# EAGLE schematic Temperature Measure Eagle (EAGLE 9.6.1)
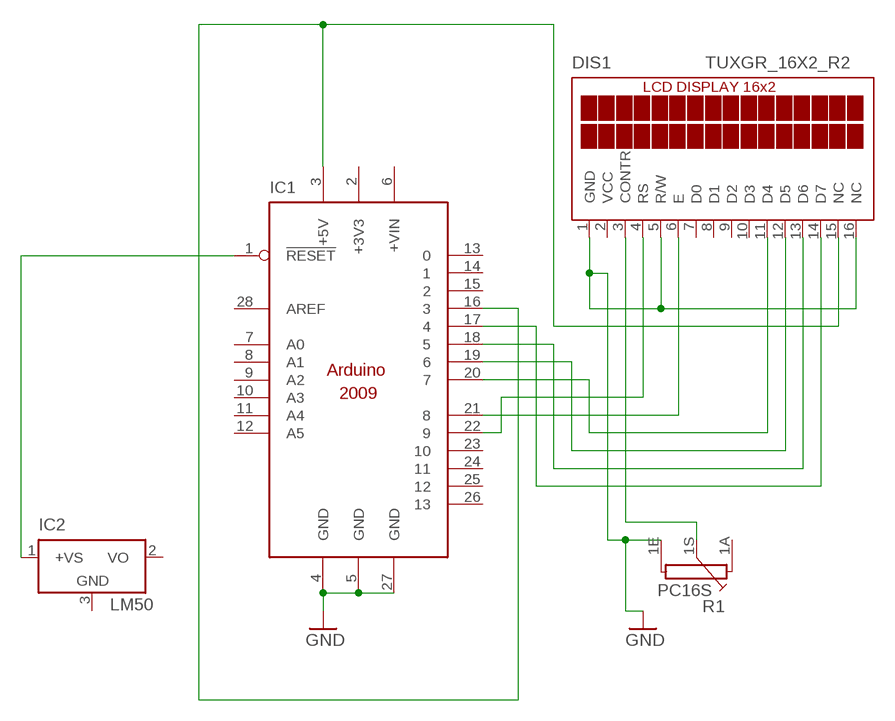
[diagram p0: schematic, sheet 1]

## Parts
DIS1  TUXGR_16X2_R2  [TUXGR_16X2_R2]
IC1  ARDUINO2009_12  [ARDUINO2009_2]
IC2  LM50  [SOT23]
R1  PC16S  [PC16S]

## Nets
GND: DIS1.1(GND) DIS1.5(R/W) DIS1.16(NC) IC1.4(GND) IC1.5(GND) IC1.27(GND) R1.1E
N$2: DIS1.15(NC) IC1.3(+5V) IC1.16
N$3: DIS1.14(D7) IC1.17
N$4: DIS1.13(D6) IC1.18
N$5: DIS1.12(D5) IC1.19
N$6: DIS1.11(D4) IC1.20
N$7: DIS1.6(E) IC1.21
N$8: DIS1.4(RS) IC1.22
N$9: DIS1.3(CONTR) R1.1S
N$10: IC1.1(!RESET) IC2.1(+VS)
Unconnected: DIS1.7(D0) DIS1.8(D1) DIS1.9(D2) DIS1.10(D3) IC1.6(+VIN) IC1.7(A0) IC1.8(A1) IC1.9(A2) IC1.10(A3) IC1.11(A4) IC1.12(A5) IC1.13 IC1.14 IC1.15 IC1.23 IC1.24 IC1.25 IC1.26 IC1.28(AREF) IC2.2(VO) R1.1A

## Power pins joined to a net without a drawn wire
+3V3: IC1.2(+3V3)
GND: IC2.3(GND)
VCC: DIS1.2(VCC)

## Library data of the parts
DIS1 = display-lcd:TUXGR_16X2_R2: Tuxgraphics LCD display 16x2 characters reflective, without background light Source: tuxgr_12x2_r2.pdf; OC_FARNELL: unknown; OC_NEWARK: unknown
IC1 = arduino:ARDUINO2009_1: The Arduino Duemilanove ("2009") is a microcontroller board based on the ATmega168 or ATmega328. - 14 digital input/output pins (of which 6 can be used as PWM outputs) - 6 analog inputs, a 16 MHz crystal oscillator - USB connection - power jack - ISP header - reset button It contains everything needed to support the microcontroller; simply connect it to a computer with a USB cable or power it with a AC-to-DC adapter or battery to get started http://arduino.cc/en/Main/ArduinoBoardDuemilanove
IC2 = linear:LM50: SOT-23 Single-Supply Centigrade Temperature Sensor Vout = (10mV/°C x Temp °C) +5mmmV Source: http://cache.national.com/ds/LM/LM50.pdf
R1 = piher:PC16S: POTENTIOMETER single carbon potentiometer, 16 mm, S3ROH; OC_FARNELL: 4452940; OC_NEWARK: unknown